# Altium schematic sheet carte_actionneur_1A.SchDoc
size A
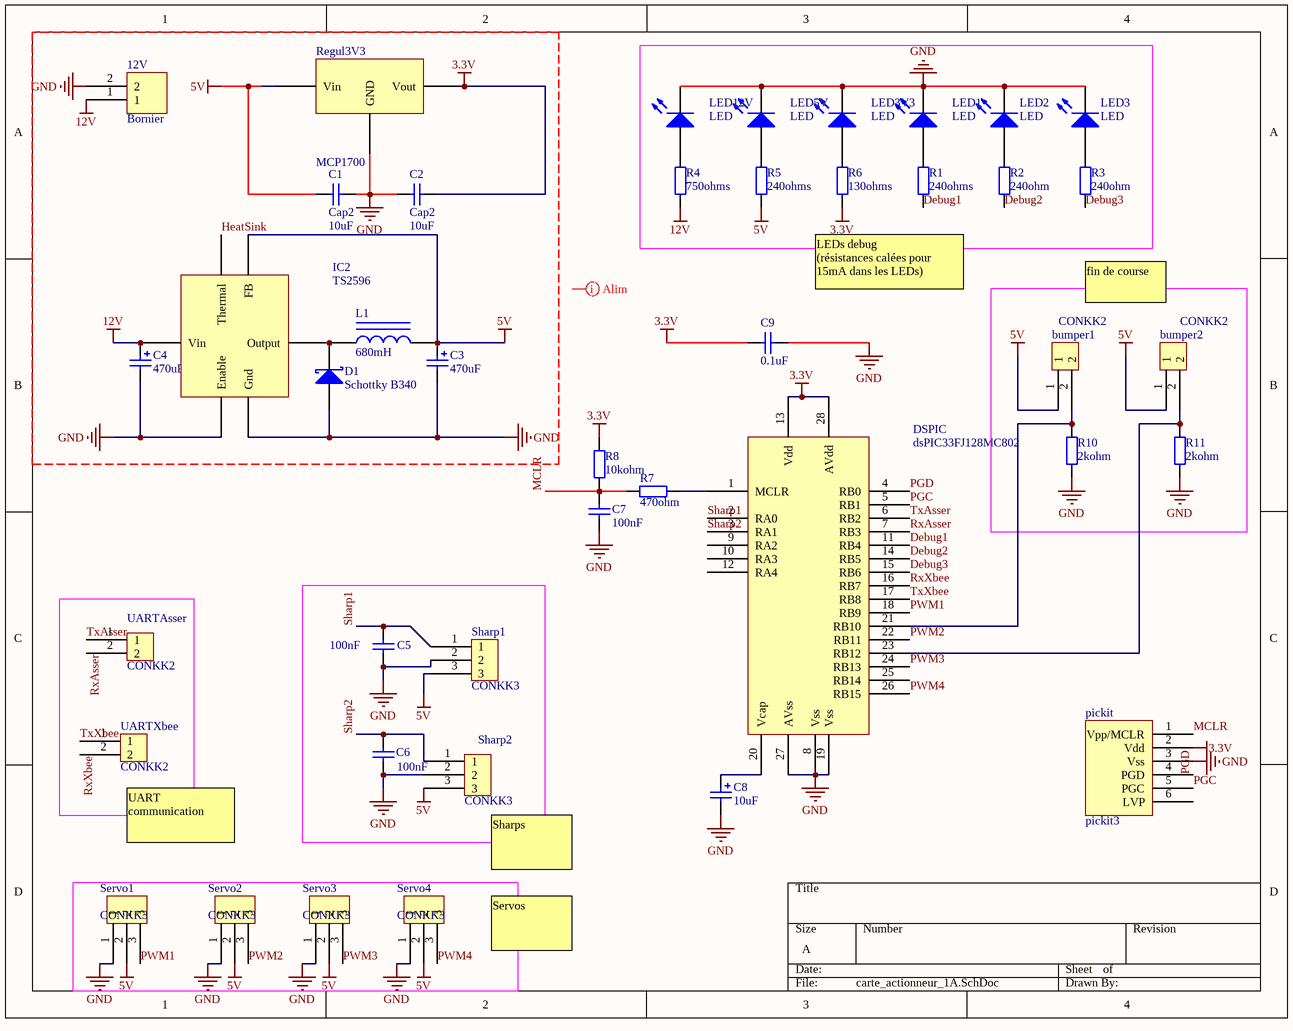
[diagram p0: carte_actionneur_1A.SchDoc]

## Parts
12V  Bornier  [Bornier]
bumper1  CONKK2  [CONKK2]
bumper2  CONKK2  [CONKK2]
C1  Cap2  value 10uF  [CAPA2]
C2  Cap2  value 10uF  [CAPA2]
C3  470uF  [Capa_pol1]
C4  470uF  [Capa_pol1]
C5  100nF  [cms805]
C6  100nF  [cms805]
C7  100nF  [cms805]
C8  10uF  [Capa_pol1]
C9  0.1uF  [cms805]
D1  Schottky B340  [SMC]
DSPIC  dsPIC33FJ128MC802  [SOIC28(300mil)]
IC2  TS2596  [TO263-5L]
L1  Valeur: 680mH  [self]  (hidden comment: Inductance)
LED1  LED  [cms805]
LED2  LED  [cms805]
LED3  LED  [cms805]
LED3V3  LED  [cms805]
LED5V  LED  [cms805]
LED12V  LED  [cms805]
pickit  pickit3  [pickit3]
R1  240ohms  [cms805]
R2  240ohm  [cms805]
R3  240ohm  [cms805]
R4  750ohms  [cms805]
R5  240ohms  [cms805]
R6  130ohms  [cms805]
R7  470ohm  [cms805]
R8  10kohm  [cms805]
R10  2kohm  [cms805]
R11  2kohm  [cms805]
Regul3V3  MCP1700  [SOT89]
Servo1  CONKK3  [CONKK3]
Servo2  CONKK3  [CONKK3]
Servo3  CONKK3  [CONKK3]
Servo4  CONKK3  [CONKK3]
Sharp1  CONKK3  [CONKK3]
Sharp2  CONKK3  [CONKK3]
UARTAsser  CONKK2  [CONKK2]
UARTXbee  CONKK2  [CONKK2]

## Nets
3.3V: C2.2 C9.1 DSPIC.13(Vdd) DSPIC.28(AVdd) pickit.2(Vdd) R6.1 R8.1 Regul3V3.3(Vout)
5V: bumper1.1 bumper2.1 C1.1 C3.1 IC2.4(FB) L1.2 R5.1 Regul3V3.2(Vin) Servo1.2 Servo2.2 Servo3.2 Servo4.2 Sharp1.3 Sharp2.3
12V: 12V.1 C4.1 IC2.1(Vin) R4.1
GND: 12V.2 C1.2 C2.1 C3.2 C4.2 C5.1 C6.1 C7.1 C8.2 C9.2 D1.1(A) DSPIC.8(Vss) DSPIC.19(Vss) DSPIC.27(AVss) IC2.3(Gnd) IC2.5(Enable) LED1.2(K) LED2.2(K) LED3.2(K) LED3V3.2(K) LED5V.2(K) LED12V.2(K) pickit.3(Vss) R10.1 R11.1 Regul3V3.1(GND) Servo1.1 Servo2.1 Servo3.1 Servo4.1 Sharp1.2 Sharp2.2
Debug1: DSPIC.11(RB4) R1.1
Debug2: DSPIC.14(RB5) R2.1
Debug3: DSPIC.15(RB6) R3.1
HeatSink: IC2.0(Thermal)
MCLR: C7.2 pickit.1(Vpp/MCLR) R7.2 R8.2
PGC: DSPIC.5(RB1) pickit.5(PGC)
PGD: DSPIC.4(RB0) pickit.4(PGD)
PWM1: DSPIC.18(RB9) Servo1.3
PWM2: DSPIC.22(RB11) Servo2.3
PWM3: DSPIC.24(RB13) Servo3.3
PWM4: DSPIC.26(RB15) Servo4.3
RxAsser: DSPIC.7(RB3) UARTAsser.2
RxXbee: DSPIC.16(RB7) UARTXbee.2
Sharp1: C5.2 DSPIC.2(RA0) Sharp1.1
Sharp2: C6.2 DSPIC.3(RA1) Sharp2.1
TxAsser: DSPIC.6(RB2) UARTAsser.1
TxXbee: DSPIC.17(RB8) UARTXbee.1
Netbumper1_2: bumper1.2 DSPIC.21(RB10) R10.2
Netbumper2_2: bumper2.2 DSPIC.23(RB12) R11.2
NetC8_1: C8.1 DSPIC.20(Vcap)
NetD1_2: D1.2(K) IC2.2(Output) L1.1
NetDSPIC_1: DSPIC.1(MCLR) R7.1
NetLED1_1: LED1.1(A) R1.2
NetLED2_1: LED2.1(A) R2.2
NetLED3_1: LED3.1(A) R3.2
NetLED3V3_1: LED3V3.1(A) R6.2
NetLED5V_1: LED5V.1(A) R5.2
NetLED12V_1: LED12V.1(A) R4.2

Not connected (* = marked no-connect by the designer): DSPIC 9(RA2) 10(RA3) 12(RA4) 25(RB14); pickit 6(LVP)

## Layout directives
net class Undefined: (no net found under the mark)

## Notes on the sheet
- LEDs debug
  (résistances calées pour 15mA dans les LEDs)
- fin de course
- (near UARTXbee) UART communication
- (near Sharp2) Sharps
- Servos

## Library data of the parts
12V = Bornier2
C1 C2 = Cap2: Capacitor; Published: 8-Jun-2000; LatestRevisionDate: 17-Jul-2002; LatestRevisionNote: Re-released for DXP Platform.; PackageReference: RAD-0.3; Publisher: Altium Limited
C3 C4 C8 = Capa Pol
C5-C7 C9 = Capa
R1-R8 R10 R11 = Resistance